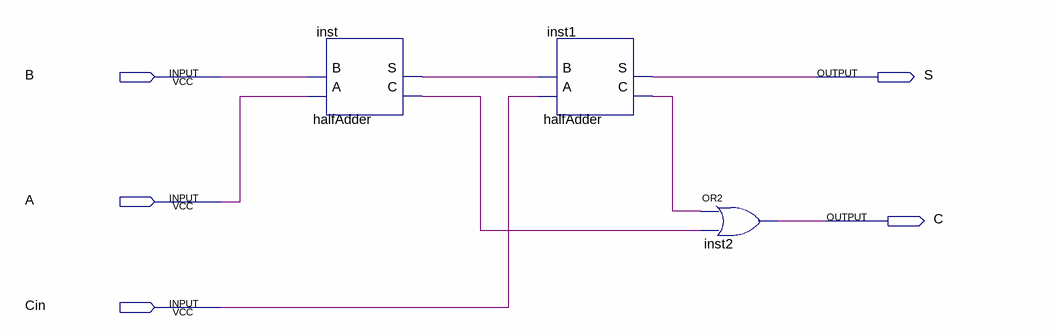
[diagram p0: schematic sheet]
// Quartus schematic fullAdder.bdf as structural Verilog: 3 symbols, 5 pins
module fullAdder (
  input  B,
  input  A,
  input  Cin,
  output S,
  output C
);

  wire inst1_c, inst_c, inst_s;

  halfAdder inst (.A(A), .B(B), .C(inst_c), .S(inst_s));
  halfAdder inst1 (.A(Cin), .B(inst_s), .C(inst1_c), .S(S));
  or inst2 (C, inst1_c, inst_c);
endmodule
